# EasyEDA schematic SP26_Knockoffvendingmachine_PCBjson_NathanDimino.json
TITLE: Sheet_1; REV: 1.0; Date: 2026-03-13; Sheet: 1/1; Drawn By: diminonathan; Company: Your Company
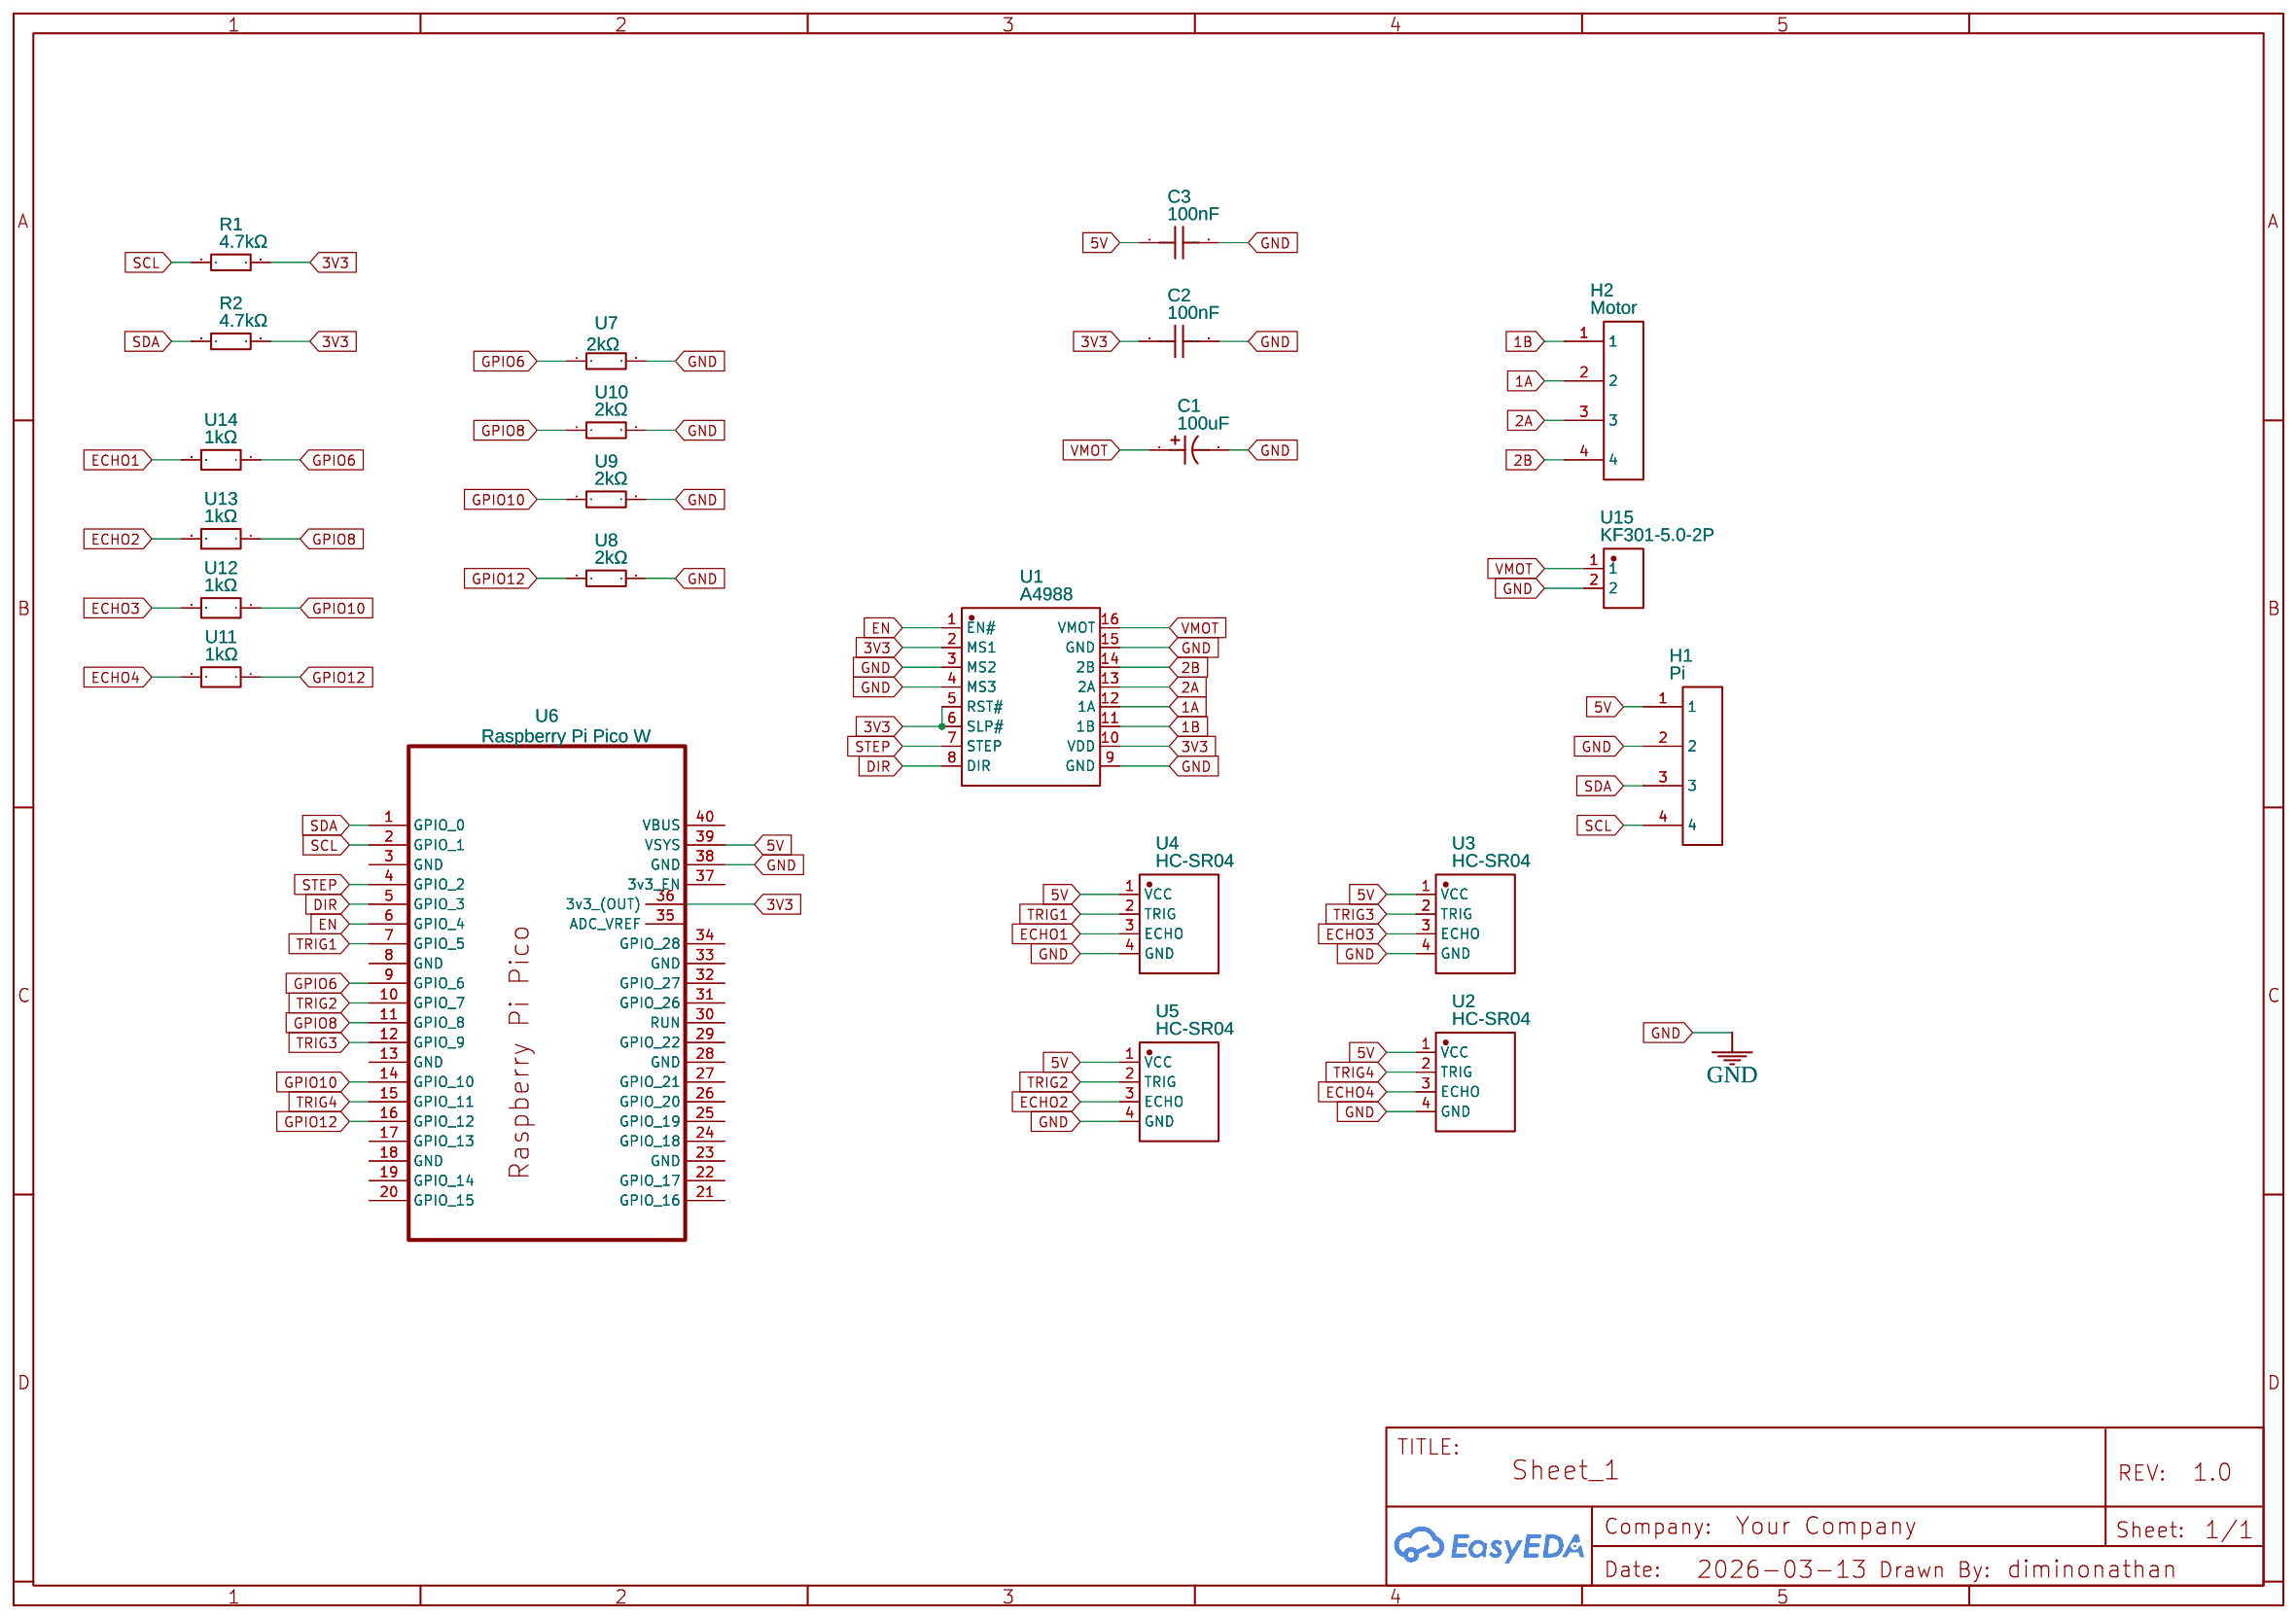
[diagram p0: schematic sheet]

## Parts
C1  100uF  [CAP-TH_BD6.3-P2.5-D0.6-FD-RYHG35V100UF]
C2  100nF  [C0805]
C3  100nF  [C0805]
H1  Pi  [2.00MM 1X4 HEADER]
H2  Motor  [2.00MM 1X4 HEADER]
R1  4.7kΩ  [RES-TH_BD3.3-L9.0-P13.00-D0.6]
R2  4.7kΩ  [RES-TH_BD3.3-L9.0-P13.00-D0.6]
U1  A4988  [DIP-16_L20.3-W15.2-P2.54_LS12.7_A4988]
U2  HC-SR04  [TH_HC-SR04V]
U3  HC-SR04  [TH_HC-SR04V]
U4  HC-SR04  [TH_HC-SR04V]
U5  HC-SR04  [TH_HC-SR04V]
U6  Raspberry Pi Pico W  [RASPBERRY PI PICO/ RASPBERRY PI PICO W]
U7  2kΩ  [RES-TH_BD3.3-L9.0-P13.00-D0.6]
U8  2kΩ  [RES-TH_BD3.3-L9.0-P13.00-D0.6]
U9  2kΩ  [RES-TH_BD3.3-L9.0-P13.00-D0.6]
U10  2kΩ  [RES-TH_BD3.3-L9.0-P13.00-D0.6]
U11  1kΩ  [RES-TH_BD8.0-L22.0-P26.00-D0.8]
U12  1kΩ  [RES-TH_BD8.0-L22.0-P26.00-D0.8]
U13  1kΩ  [RES-TH_BD8.0-L22.0-P26.00-D0.8]
U14  1kΩ  [RES-TH_BD8.0-L22.0-P26.00-D0.8]
U15  KF301-5.0-2P  [CONN-TH_P5.00_KF301-5.0-2P]

## Library data of the parts
C1 = RYHG35V100UF6*8: Supplier: LCSC; Supplier Part: C48970442; Manufacturer: HONOR(荣誉); JLCPCB Part Class: Extended Part; Contributor: lcsc
C2 C3 = CGA4J3X7T2E104M125AA: Contributor: lcsc; Supplier: LCSC; Supplier Part: C3881040; Manufacturer: TDK
H1 H2 = 1x4 2.00mm header: Manufacturer Part: 2.00mm 1 x 4; Contributor: rupin.chheda
R1 R2 = MF1/2W-4.7KΩ±1% T52: Contributor: LCSC; Supplier: LCSC; Supplier Part: C119429; Manufacturer: CCO(千志电子); Manufacturer Part: MF1/2W-4.7KΩ±1% T; JLCPCB Part Class: Extended Part
U1 = A4988: Supplier: LCSC; Supplier Part: C9900168373; Manufacturer: null; Contributor: lcsc
U2-U5 = HC-SR04: Supplier: LCSC; Supplier Part: C19857336; Manufacturer: Universal Microelectronics; Contributor: lcsc; JLCPCB Part Class: Extended Part
U6 = Raspberry Pi Pico W: Contributor: organicsaswat1452
U7-U10 = MFR1WSFRE52-2K: Contributor: lcsc; Supplier: LCSC; Supplier Part: C1753369; Manufacturer: YAGEO(国巨); JLCPCB Part Class: Extended Part
U11-U14 = SQP300JB-1K: Contributor: lcsc; Supplier: LCSC; Supplier Part: C1392846; Manufacturer: YAGEO(国巨); JLCPCB Part Class: Extended Part
U15 = KF301-5.0-2P: Contributor: LCSC; Supplier: LCSC; Supplier Part: C474881; Manufacturer: KEFA(科发); JLCPCB Part Class: Extended Part

## Nets
3V3: C2.1 R1.2 R2.2 U1.2(MS1) U1.5(RST#) U1.6(SLP#) U1.10(VDD) U6.36(3v3 (OUT))
5V: C3.1 H1.1 U2.1(VCC) U3.1(VCC) U4.1(VCC) U5.1(VCC) U6.39(VSYS)
GND: C1.2 C2.2 C3.2 H1.2 U1.3(MS2) U1.4(MS3) U1.9(GND) U1.15(GND) U2.4(GND) U3.4(GND) U4.4(GND) U5.4(GND) U6.38(GND) U7.2 U8.2 U9.2 U10.2 U15.2
1A: H2.2 U1.12(1A)
1B: H2.1 U1.11(1B)
2A: H2.3 U1.13(2A)
2B: H2.4 U1.14(2B)
DIR: U1.8(DIR) U6.5(GPIO 3)
ECHO1: U4.3(ECHO) U14.2
ECHO2: U5.3(ECHO) U13.2
ECHO3: U3.3(ECHO) U12.2
ECHO4: U2.3(ECHO) U11.2
EN: U1.1(EN#) U6.6(GPIO 4)
GPIO6: U6.9(GPIO 6) U7.1 U14.1
GPIO8: U6.11(GPIO 8) U10.1 U13.1
GPIO10: U6.14(GPIO 10) U9.1 U12.1
GPIO12: U6.16(GPIO 12) U8.1 U11.1
SCL: H1.4 R1.1 U6.2(GPIO 1)
SDA: H1.3 R2.1 U6.1(GPIO 0)
STEP: U1.7(STEP) U6.4(GPIO 2)
TRIG1: U4.2(TRIG) U6.7(GPIO 5)
TRIG2: U5.2(TRIG) U6.10(GPIO 7)
TRIG3: U3.2(TRIG) U6.12(GPIO 9)
TRIG4: U2.2(TRIG) U6.15(GPIO 11)
VMOT: C1.1 U1.16(VMOT) U15.1

Not connected (* = marked no-connect by the designer): U6 3(GND) 8(GND) 13(GND) 17(GPIO 13) 18(GND) 19(GPIO 14) 20(GPIO 15) 21(GPIO 16) 22(GPIO 17) 23(GND) 24(GPIO 18) 25(GPIO 19) 26(GPIO 20) 27(GPIO 21) 28(GND) 29(GPIO 22) 30(RUN) 31(GPIO 26) 32(GPIO 27) 33(GND) 34(GPIO 28) 35(ADC_VREF) 37(3v3_EN) 40(VBUS)
